# Altium schematic sheet ESP32.SchDoc: Humpback
size 420 x 297 mm; Author: G.Kasprowicz; CompanyName: WUT ISE; DrawnBy: G.Kasprowicz; Organization: WUT ISE; Address1: PW ISE; Address2: Nowowiejska 15/19 00-665 Warsaw; Address3: gkasprow@gmail.com; DocumentNumber: 9; Revision: 1.0; SheetNumber: 9; SheetTotal: 11; ModifiedBy: -; CheckedDate: -; Title2: ESP32 v1.0; DivGrp: WUT ISE; Designer: G.Kasprowicz; ModifiedDate: -; ProjectName: Sensor Box
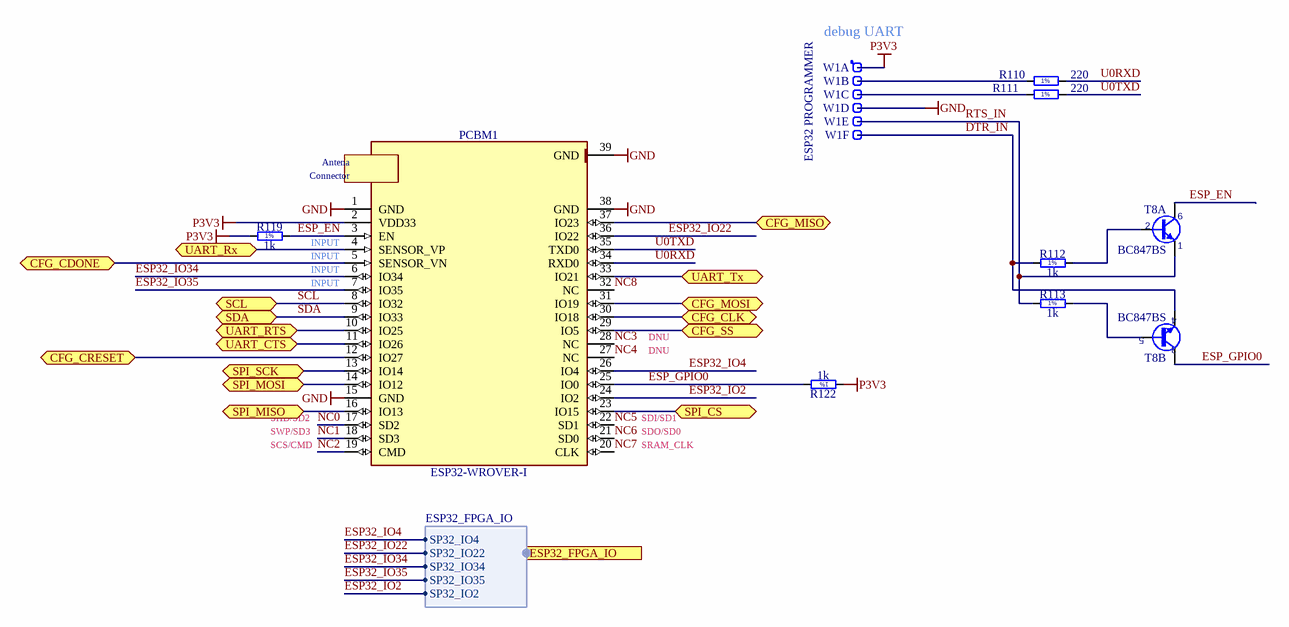
[diagram p0: ESP32.SchDoc]

## Parts
PCBM1  ESP32-WROVER-I  [PCBM_ESP32-WROVER-I]
R110  220  [RESC1005X40N]
R111  220  [RESC1005X40N]
R112  1k  [RESC1005X40N]
R113  1k  [RESC1005X40N]
R119  1k  [RESC1005X40N]
R122  1k  [RESC1005X40N]
T8  BC847BS  [SOT65P210X110-6N]  (parts A,B of 2)
W1  Header 6  [SAMTEC_MTLW-106-07-L-S-250]  (value not drawn)  (parts A,B,C,D,E,F of 6)

## Ports
CFG_CDONE (bidir), CFG_CLK (bidir), CFG_CRESET (bidir), CFG_MISO (bidir), CFG_MOSI (bidir), CFG_SS (bidir), ESP32_FPGA_IO (harness ESP32_FPGA_IO), SCL (bidir), SDA (bidir), SPI_CS (bidir), SPI_MISO (bidir), SPI_MOSI (bidir), SPI_SCK (bidir), UART_CTS (bidir), UART_RTS (bidir), UART_Rx (bidir), UART_Tx (bidir)

## Harnesses
ESP32_FPGA_IO: SP32_IO4, SP32_IO22, SP32_IO34, SP32_IO35, SP32_IO2

## Nets
GND: PCBM1.1(GND) PCBM1.15(GND) PCBM1.38(GND) PCBM1.39(GND) W1.4
P3V3: PCBM1.2(VDD33) R119.1 R122.1 W1.1
CFG_CDONE: PCBM1.5(SENSOR_VN) ; port CFG_CDONE
CFG_CLK: PCBM1.30(IO18) ; port CFG_CLK
CFG_CRESET: PCBM1.12(IO27) ; port CFG_CRESET
CFG_MISO: PCBM1.37(IO23) ; port CFG_MISO
CFG_MOSI: PCBM1.31(IO19) ; port CFG_MOSI
CFG_SS: PCBM1.29(IO5) ; port CFG_SS
DTR_IN: R112.1 T8.4(E) W1.6
ESP32_IO2: PCBM1.24(IO2) ; port ESP32_FPGA_IO.SP32_IO2
ESP32_IO4: PCBM1.26(IO4) ; port ESP32_FPGA_IO.SP32_IO4
ESP32_IO22: PCBM1.36(IO22) ; port ESP32_FPGA_IO.SP32_IO22
ESP32_IO34: PCBM1.6(IO34) ; port ESP32_FPGA_IO.SP32_IO34
ESP32_IO35: PCBM1.7(IO35) ; port ESP32_FPGA_IO.SP32_IO35
ESP_EN: PCBM1.3(EN) R119.2 T8.6(C)
ESP_GPIO0: PCBM1.25(IO0) R122.2 T8.3(C)
NC0: PCBM1.17(SD2)
NC1: PCBM1.18(SD3)
NC2: PCBM1.19(CMD)
NC3: PCBM1.28(NC)
NC4: PCBM1.27(NC)
NC5: PCBM1.22(SD1)
NC6: PCBM1.21(SD0)
NC7: PCBM1.20(CLK)
NC8: PCBM1.32(NC)
RTS_IN: R113.1 T8.1(E) W1.5
SCL: PCBM1.8(IO32) ; port SCL
SDA: PCBM1.9(IO33) ; port SDA
SPI_CS: PCBM1.23(IO15) ; port SPI_CS
SPI_MISO: PCBM1.16(IO13) ; port SPI_MISO
SPI_MOSI: PCBM1.14(IO12) ; port SPI_MOSI
SPI_SCK: PCBM1.13(IO14) ; port SPI_SCK
U0RXD: PCBM1.34(RXD0) R110.2
U0TXD: PCBM1.35(TXD0) R111.2
UART_CTS: PCBM1.11(IO26) ; port UART_CTS
UART_RTS: PCBM1.10(IO25) ; port UART_RTS
UART_Rx: PCBM1.4(SENSOR_VP) ; port UART_Rx
UART_Tx: PCBM1.33(IO21) ; port UART_Tx
NetR110_1: R110.1 W1.2
NetR111_1: R111.1 W1.3
NetR112_2: R112.2 T8.2(B)
NetR113_2: R113.2 T8.5(B)

## Notes on the sheet
- (near W1) debug UART
- (near W1) ESP32 PROGRAMMER
- INPUT
- DNU
- SHD/SD2
- SDI/SD1
- SWP/SD3
- SCS/CMD
- SDO/SD0
- SRAM_CLK
- Project/Equipment
- Document
- Designer
- Drawn by
- Check.by
- Copyright WUT ISE 2018.
  This documentation describes Open Hardware and is licensed under the CERN OHL v.1.1. You may redistribute and modify this documentation under the terms of the CERN OHL v.1.1. (http://ohwr.org/CERNOHL). This documentation is distributed WITHOUT ANY EXPRESS OR IMPLIED WARRANTY, INCLUDING OF MERCHANTABILITY, SATISFACTORY QUALITY AND FITNESS FOR A PARTICULAR PURPOSE. Please see the CERN OHL v.1.1 for applicable conditions.
- Contact
- File
- Last Mod.
- Print Date
- Sheet
- Size
- A3
- of
- Rev
- (in symbol PCBM_ESP32-WROVER-I) Antena; Connector
- (in symbol R0402_1K_1%_0.0625W_100PPM) 1%
- (in symbol R0402_220R_1%_0.0625W_100PPM) 1%

## Library data of the parts
PCBM1 = PCBM_ESP32-WROVER-I: Generic WiFi-BT-BLE MCU Module; Part Description: Generic WiFi-BT-BLE MCU Module (IPEX antenna, 32-Mbit PSRAM); Manufacturer: ESPRESSIF; PressFit: No; Bonding: No; Part Number: PCBM_ESP32-WROVER-I; Component Kind: Standard; Component Type: Standard; Device: ESP32-WROVER-I; PackageDescription: Generic WiFi-BT-BLE MCU Module (IPEX antenna) ,Body 18.00mm x 31.4mm; Manufacturer Part Number: ESP32-WROVER-I; Pin Count: 39; Mounted: Yes; Socket: No; SMD: Yes; Sense: No; ComponentHeight: 3.65mm; Author: CERN DEM JLC; HelpURL: \\cern.ch\dfs\Applications\Altium\Datasheets\PCBM_ESP32-WROVER-I.pdf; CreateDate: 14/11/2017; LatestRevisionDate: 14/11/2017
R110 R111 = R0402_220R_1%_0.0625W_100PPM: Resistor - 1%; Part Description: General Purpose Thick Film Chip Resistor; Manufacturer: GENERIC; Manufacturer1 Part Number: 232270672201L; TC: ±100ppm/°C; PressFit: No; Part Number: R0402_220R_1%_0.0625W_100PPM; Component Kind: Standard; Component Type: Standard; Pin Count: 2; Value: 220; Status: Not Recommended; Power: 0.0625W; Tolerance: ±1%; Manufacturer Part Number: R0402_220R_1%_0.0625W_100PPM; Case: 0402; Mounted: Yes; Sense: No; Socket: No; SMD: Yes; Manufacturer1 Example: YAGEO PHYCOMP; Manufacturer1 ComponentHeight: 0.4mm; HelpURL: \\cern.ch\dfs\Applications\Altium\Datasheets\R0402_Phycomp_RC0402.pdf; Author: CERN DEM JLC; CreateDate: 03.12.2007; LatestRevisionDate: 17.10.2012
R112 R113 R119 R122 = R0402_1K_1%_0.0625W_100PPM: Resistor - 1%; Part Description: General Purpose Thick Film Chip Resistor; Manufacturer: GENERIC; Manufacturer1 Part Number: 232270671002L; TC: ±100ppm/°C; PressFit: No; Part Number: R0402_1K_1%_0.0625W_100PPM; Component Kind: Standard; Component Type: Standard; Pin Count: 2; Value: 1k; Status: Not Recommended; Power: 0.0625W; Tolerance: ±1%; Manufacturer Part Number: R0402_1K_1%_0.0625W_100PPM; Case: 0402; Mounted: Yes; Sense: No; Socket: No; SMD: Yes; Manufacturer1 Example: YAGEO PHYCOMP; Manufacturer1 ComponentHeight: 0.4mm; HelpURL: \\cern.ch\dfs\Applications\Altium\Datasheets\R0402_Phycomp_RC0402.pdf; Author: CERN DEM JLC; CreateDate: 03.12.2007; LatestRevisionDate: 17.10.2012
T8 = BC847BS: 45V 100mA Dual NPN General-Purpose Transistor; Manufacturer: NXP SEMICONDUCTORS; PressFit: No; Bonding: No; Part Number: BC847BS; Component Kind: Standard; Component Type: Standard; Device: BC847BS; PackageDescription: SOT363, SC-88, SOT, 0.65mm Pitch, 6 pin, 1.25mm W X 2.00mm L X 1.10mm H, IPC Medium Density; Part Description: 45V 100mA Dual NPN General-Purpose Transistor; Manufacturer Part Number: BC847BS; Pin Count: 6; Case: SOT363; Mounted: Yes; Socket: No; SMD: Yes; Sense: No; ComponentHeight: 1.1mm; HelpURL: \\cern.ch\dfs\Applications\Altium\Datasheets\BC847BS.pdf; Author: CERN DEM JMW; CreateDate: 10.07.2015; LatestRevisionDate: 10.07.2015
W1 = SAMTEC_MTLW-106-07-L-S-250: 6 Mini Wire-Wrap Contact Strip Header; Part Description: 6 Contacts, Pitch 2.54mm, Single Row Through Mount Straight Header (Post Lead = 6.35mm, Tail Lead 3.05mm, Insulator 1.52mm); Manufacturer: SAMTEC; PressFit: No; Part Number: SAMTEC_MTLW-106-07-L-S-250; Component Kind: Standard; Component Type: Standard; Pin Count: 6; Family: Header 6; Mounted: Yes; Socket: No; Sense: No; SMD: No; Status: None; Manufacturer Part Number: MTLW-106-07-L-S-250; ComponentHeight: 7.87mm; HelpURL: \\cern.ch\dfs\Applications\Altium\Datasheets\SAMTEC_MTLW-106-07-L-S-250.pdf; Author: CERN DEM BC; CreateDate: 06/03/2017; LatestRevisionDate: 06/03/2017